# Altium schematic sheet Power_Input_Circuit.SchDoc
size B; Organization: Altium Limited; Address1: L3, 12a Rodborough Rd; Address2: Frenchs Forest; Address3: NSW; Address4: Australia 2086; DocumentNumber: 20; SheetNumber: 17; SheetTotal: 21
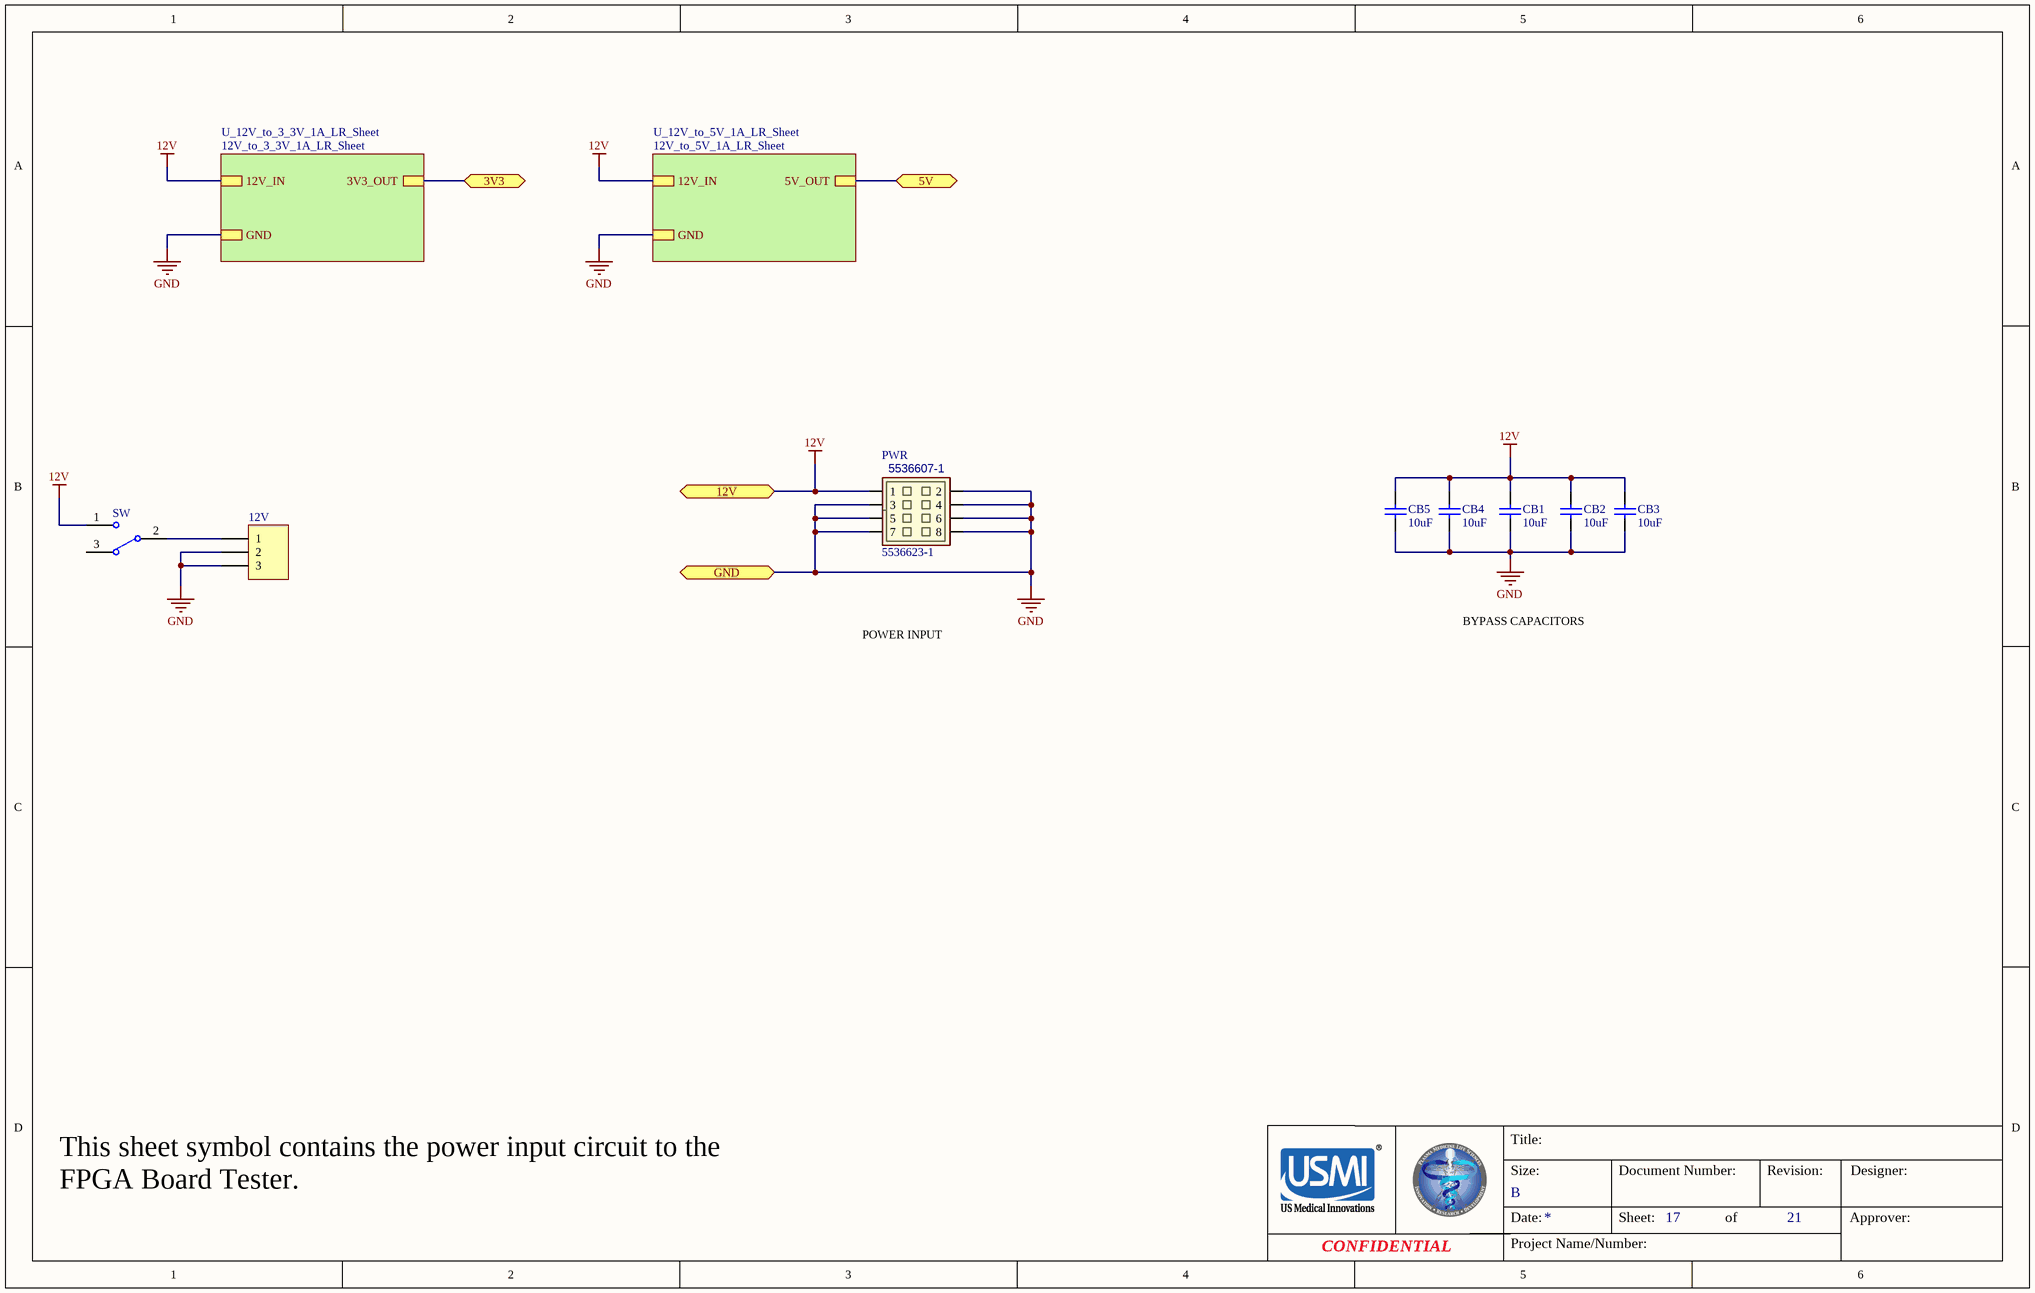
[diagram p0: Power_Input_Circuit.SchDoc]

## Parts
12V  Header 3  [HDR1X3_12V]  (value not drawn)
CB1  10uF  [1206c]
CB2  10uF  [1206c]
CB3  10uF  [1206c]
CB4  10uF  [1206c]
CB5  10uF  [1206c]
PWR  5536623-1  [5536623-1]
SW  SW  [CS12ANW03]  (value not drawn)

## Sub-sheets
U_12V_to_3_3V_1A_LR_Sheet = 12V_to_3_3V_1A_LR_Sheet: GND, 12V_IN, 3V3_OUT
U_12V_to_5V_1A_LR_Sheet = 12V_to_5V_1A_LR_Sheet: GND, 12V_IN, 5V_OUT

## Ports
3V3, 5V, 12V, GND

## Nets
12V: CB1.2 CB2.2 CB3.2 CB4.2 CB5.2 PWR.1 SW.1 ; port 12V, sheet U_12V_to_3_3V_1A_LR_Sheet/12V_IN, sheet U_12V_to_5V_1A_LR_Sheet/12V_IN
GND: 12V.2 12V.3 CB1.1 CB2.1 CB3.1 CB4.1 CB5.1 PWR.2 PWR.3 PWR.4 PWR.5 PWR.6 PWR.7 PWR.8 ; port GND, sheet U_12V_to_3_3V_1A_LR_Sheet/GND, sheet U_12V_to_5V_1A_LR_Sheet/GND
3V3: port 3V3, sheet U_12V_to_3_3V_1A_LR_Sheet/3V3_OUT
5V: port 5V, sheet U_12V_to_5V_1A_LR_Sheet/5V_OUT
Net12V_1: 12V.1 SW.2

Not connected (* = marked no-connect by the designer): SW 3

## Notes on the sheet
- BYPASS CAPACITORS
- POWER INPUT
- Title:
- Size:
- Document Number:
- Revision:
- Designer:
- This sheet symbol contains the power input circuit to the FPGA Board Tester.
- Date:
- Project Name/Number:
- B
- Sheet:
- of
- Approver:
- CONFIDENTIAL

## Library data of the parts
12V = Header 3: Header, 3-Pin; LatestRevisionDate: 17-Jul-2002; LatestRevisionNote: Re-released for DXP Platform.; Publisher: Altium Limited; Supplier 1: Digi-Key; Supplier Part Number 2: WM8214-ND; Supplier 2: Digi-Key; Supplier Part Number 1: A32564-ND
CB1-CB5 = Cap: Capacitor; Published: 8-Jun-2000; LatestRevisionDate: 17-Jul-2002; LatestRevisionNote: Re-released for DXP Platform.; PackageReference: RAD-0.3; Publisher: Altium Limited; PackageDescription: Radial Cap, Thru-Hole; 2 Leads; 0.3 in Pin Spacing; Value: 10uF; Supplier 1: Digi-Key; Supplier Part Number 1: 1276-2876-1-ND
PWR = 5536607-1: TE Z-Pack 5536607-1; Supplier 2: Mouser; Supplier 1: Digi-Key; Supplier Part Number 2: 571-5536607-1; Supplier Part Number 1: 5536623-1-ND
SW = SW-SPDT: SPDT Subminiature Toggle Switch, Right Angle Mounting, Vertical Actuation; Published: 24-Mar-1999; LatestRevisionDate: 17-Dec-2003; LatestRevisionNote: Schematic revised, PCB Footprint replaced.; DatasheetVersion: 05-Dec-2000; PackageReference: TL36WW15050; Publisher: Altium Limited; PackageDescription: Switch; 4 Leads; ComponentLink1Description: Manufacturer Link; ComponentLink1URL: http://www.apem.com; Supplier 1: Digi-Key; Supplier 2: Digi-Key; Supplier Part Number 2: 679-1882-ND; Supplier Part Number 1: 360-2131-ND